# EAGLE schematic Stir_Plate_Schem (EAGLE 8.3.1)
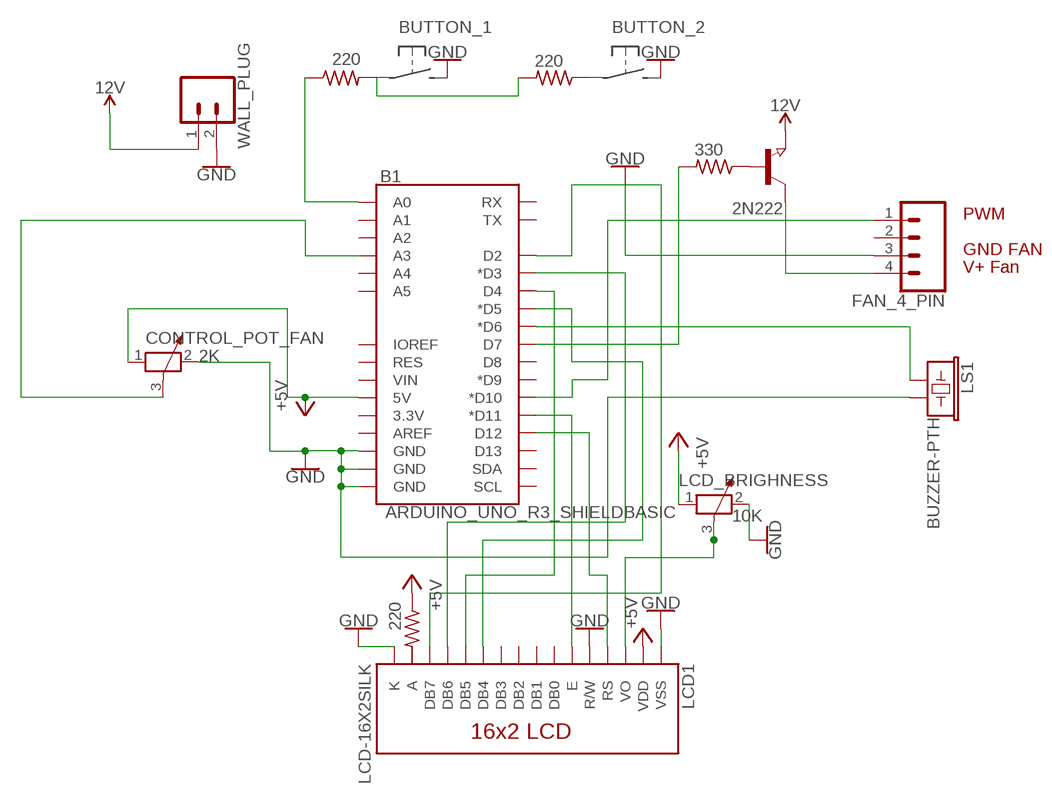
[diagram p0: schematic, sheet 1]

## Parts
B1  ARDUINO_UNO_R3_SHIELDBASIC  [UNO_R3_SHIELD]
CONTROL_POT_FAN  2K  POTENTIOMETER_PT-10  [PT-10]
FAN_4_PIN  CONN_04  [1X04]
LCD1  LCD-16X2SILK  [LCD-16X2]
LCD_BRIGHNESS  10K  POTENTIOMETER_PT-10  [PT-10]
LS1  BUZZER-PTH  [BUZZER-12MM]
Q1  2N222  NPN-TRANSISTOR_SOT23W  [SOT23W]
R1  220  R-US_0204/2V  [0204V]
R2  220  R-US_0204/2V  [0204V]
R3  220  R-US_0204/2V  [0204V]
R4  330  R-US_0204/2V  [0204V]
WALL_PLUG  CONN_02  [1X02]

## Nets
12V: Q1.3(E) WALL_PLUG.1
+5V: B1.5V CONTROL_POT_FAN.1 LCD1.2(VDD) LCD_BRIGHNESS.1 R1.1
GND: B1.GND@0(GND) B1.GND@1(GND) B1.GND@2(GND) CONTROL_POT_FAN.2 FAN_4_PIN.3 LCD1.1(VSS) LCD1.5(R/W) LCD1.16(K) LCD_BRIGHNESS.2 LS1.- WALL_PLUG.2
N$1: B1.D10(*D10) FAN_4_PIN.1
N$2: LCD1.3(VO) LCD_BRIGHNESS.3
N$3: B1.A3 CONTROL_POT_FAN.3
N$4: Q1.1(B) R4.1
N$5: B1.D6(*D6) LS1.+
N$6: B1.A0 R2.1
N$7: B1.D12 LCD1.4(RS)
N$8: B1.D11(*D11) LCD1.6(E)
N$9: B1.D5(*D5) LCD1.11(DB4)
N$10: B1.D4 LCD1.12(DB5)
N$11: B1.D2 LCD1.14(DB7)
N$12: B1.D3(*D3) LCD1.13(DB6)
N$13: R2.2 R3.2
N$14: FAN_4_PIN.4 Q1.2(C)
N$15: B1.D7 R4.2
Unconnected: B1.3.3V B1.A1 B1.A2 B1.A4 B1.A5 B1.AREF B1.D8 B1.D9(*D9) B1.D13 B1.IOREF B1.RES B1.RX B1.SCL B1.SDA B1.TX B1.VIN FAN_4_PIN.2 LCD1.7(DB0) LCD1.8(DB1) LCD1.9(DB2) LCD1.10(DB3) R1.2 R3.1

## Notes on the sheet
- PWM
- GND FAN
- V+ Fan

## Power pins joined to a net without a drawn wire
A: LCD1.15(A)

## Library data of the parts
B1 = SparkFun-Boards:ARDUINO_UNO_R3_SHIELD: Arduino R3 Shield Footprint Shield form compatible with the Arduino Uno R3. SparkFun Products: MG2639 Cellular Shield <https://www.sparkfun.com/products/13120> MIDI Shield <https://www.sparkfun.com/products/12898> R3 Stackable Headers Kit <https://www.sparkfun.com/products/11417>
CONTROL_POT_FAN LCD_BRIGHNESS = rcl:POTENTIOMETER_: Potentiometer
FAN_4_PIN = SparkFun-Connectors:CONN_04: Multi connection point. Often used as Generic Header-pin footprint for 0.1 inch spaced/style header connections On any of the 0.1 inch spaced packages, you can populate with these: Break Away Headers - Straight <https://www.sparkfun.com/products/116> (PRT-00116) Break Away Male Headers - Right Angle <https://www.sparkfun.com/products/553> (PRT-00553) Female Headers <https://www.sparkfun.com/products/115> (PRT-00115) Break Away Headers - Machine Pin <https://www.sparkfun.com/products/117> (PRT-00117) Break Away Female Headers - Swiss Machine Pin <https://www.sparkfun.com/products/743> (PRT-00743) For SCREWTERMINALS and SPRING TERMINALS visit here: Screw Terimnals on SparkFun.com <https://www.sparkfun.com/search/results?term=Screw+Terminals> (5mm/3.5mm/2.54mm spacing) This device is also useful as a general connection point to wire up your design to another part of your project. Our various solder wires solder well into these plated through hole pads. Hook-Up Wire - Assortment (Stranded, 22 AWG) <https://www.sparkfun.com/products/11375> (PRT-11375) Hook-Up Wire - Assortment (Solid Core, 22 AWG) <https://www.sparkfun.com/products/11367> (PRT-11367) View the entire wire category on our website here <https://www.sparkfun.com/categories/141> Special notes: Molex polarized connector foot print use with SKU : PRT-08231 with associated crimp pins and housings. 1MM SMD Version SKU: PRT-10208; PROD_ID: CONN-09696
LCD1 = SparkFun-Displays:LCD-16X2: Standard text-only 16x2 parallel input LCD Basic 16 character by 2 line display. Typically utilizes the extremely common HD44780 parallel interface chipset SparkFun Products: Basic 16x2 Green <https://www.sparkfun.com/products/255> Basic 8x2 Green <https://www.sparkfun.com/products/11122>; SF_ID: LCD-00255
LS1 = SparkFun-Electromechanical:BUZZER: Buzzer Small round buzzers that operate around the audible 2kHz range. You can use these as speakers to create simple music or user interfaces. Variant Overview: PTH - Mini Speaker - PC Mount 12mm 2.048kHz <https://www.sparkfun.com/products/7950> PTH_KIT - Mini Speaker - PC Mount 12mm 2.048kHz <https://www.sparkfun.com/products/7950> KIT simplifies soldering by adding stop mask to one side of the pads. PTH_NO_SILK - Mini Speaker - PC Mount 12mm 2.048kHz <https://www.sparkfun.com/products/7950> No silkscreen indicator of buzzer outline. PTH_KIT_NO_SILK - Mini Speaker - PC Mount 12mm 2.048kHz <https://www.sparkfun.com/products/7950> KIT package w/o silkscreen SMD - Buzzer Audio Magnetic (CCV-084B16) SMD buzzer used on, e.g. the LilyPad Buzzer <https://www.sparkfun.com/products/8463> and RFID USB Reader <https://www.sparkfun.com/products/9963>. SMD_KIT - Buzzer Audio Magnetic (CCV-084B16) SMD Buzzer with elongated pins to make soldering easier. Used on the SparkFun Simon Says - Surface Mount Soldering Kit <https://www.sparkfun.com/products/10935>.; PROD_ID: COMP-08253; SF_SKU: COM-07950
Q1 = semicon-smd-ipc:NPN-TRANSISTOR_: NPN TRANSISTOR
R1-R4 = rcl:R-US_: RESISTOR, American symbol
WALL_PLUG = SparkFun-Connectors:CONN_02: Multi connection point. Often used as Generic Header-pin footprint for 0.1 inch spaced/style header connections On any of the 0.1 inch spaced packages, you can populate with these: Break Away Headers - Straight <https://www.sparkfun.com/products/116> (PRT-00116) Break Away Male Headers - Right Angle <https://www.sparkfun.com/products/553> (PRT-00553) Female Headers <https://www.sparkfun.com/products/115> (PRT-00115) Break Away Headers - Machine Pin <https://www.sparkfun.com/products/117> (PRT-00117) Break Away Female Headers - Swiss Machine Pin <https://www.sparkfun.com/products/743> (PRT-00743) For SCREWTERMINALS and SPRING TERMINALS visit here: Screw Terimnals on SparkFun.com <https://www.sparkfun.com/search/results?term=Screw+Terminals> (5mm/3.5mm/2.54mm spacing) This device is also useful as a general connection point to wire up your design to another part of your project. Our various solder wires solder well into these plated through hole pads. Hook-Up Wire - Assortment (Stranded, 22 AWG) <https://www.sparkfun.com/products/11375> (PRT-11375) Hook-Up Wire - Assortment (Solid Core, 22 AWG) <https://www.sparkfun.com/products/11367> (PRT-11367) View the entire wire category on our website here <https://www.sparkfun.com/categories/141> Special notes: Molex polarized connector foot print use with: PRT-08233 with associated crimp pins and housings. 2.54_SCREWTERM for use with PRT-10571. 3.5mm Screw Terminal footprints for PRT-08084 5mm Screw Terminal footprints for use with PRT-08432